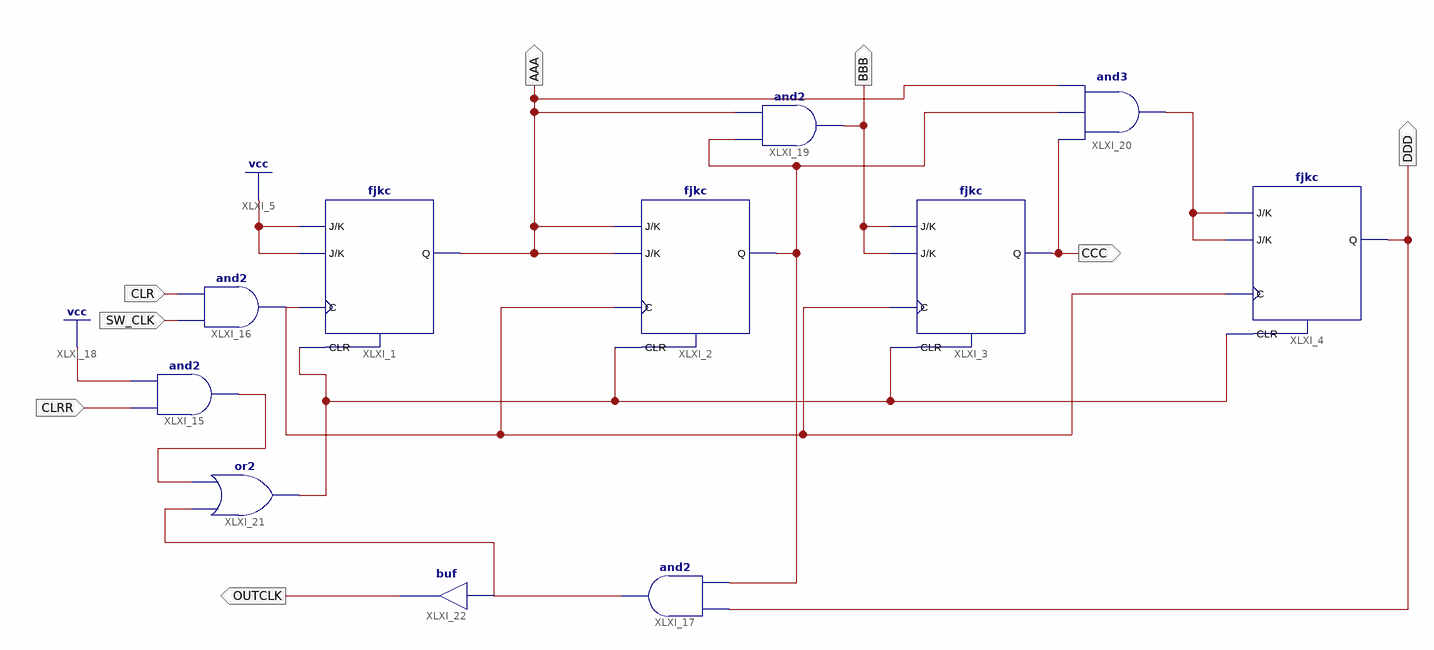
[diagram p0: schematic sheet 1]
// Xilinx ISE schematic SyncCounter0to9.sch (spartan6) as structural Verilog: 11 symbols, 8 ports
module SyncCounter0to9 (
  input  CLR,
  input  SW_CLK,
  input  CLRR,
  output OUTCLK,
  output DDD,
  output AAA,
  output BBB,
  output CCC
);

  wire XLXN_16, XLXN_44, XLXN_49, XLXN_52, XLXN_56;

  fjkc XLXI_1 (.C(XLXN_16), .CLR(XLXN_56), .J(1'b1), .K(1'b1), .Q(AAA));
  fjkc XLXI_4 (.C(XLXN_16), .CLR(XLXN_56), .J(XLXN_49), .K(XLXN_49), .Q(DDD));
  fjkc XLXI_3 (.C(XLXN_16), .CLR(XLXN_56), .J(BBB), .K(BBB), .Q(CCC));
  fjkc XLXI_2 (.C(XLXN_16), .CLR(XLXN_56), .J(AAA), .K(AAA), .Q(XLXN_44));
  and XLXI_16 (XLXN_16, SW_CLK, CLR);
  and XLXI_17 (OUTCLK, XLXN_44, DDD);
  and XLXI_19 (BBB, XLXN_44, AAA);
  and XLXI_20 (XLXN_49, CCC, XLXN_44, AAA);
  and XLXI_15 (XLXN_52, CLRR, 1'b1);
  or XLXI_21 (XLXN_56, OUTCLK, XLXN_52);
  buf XLXI_22 (OUTCLK, OUTCLK);
endmodule
